# EAGLE design CP3 (EAGLE 9.6.2)
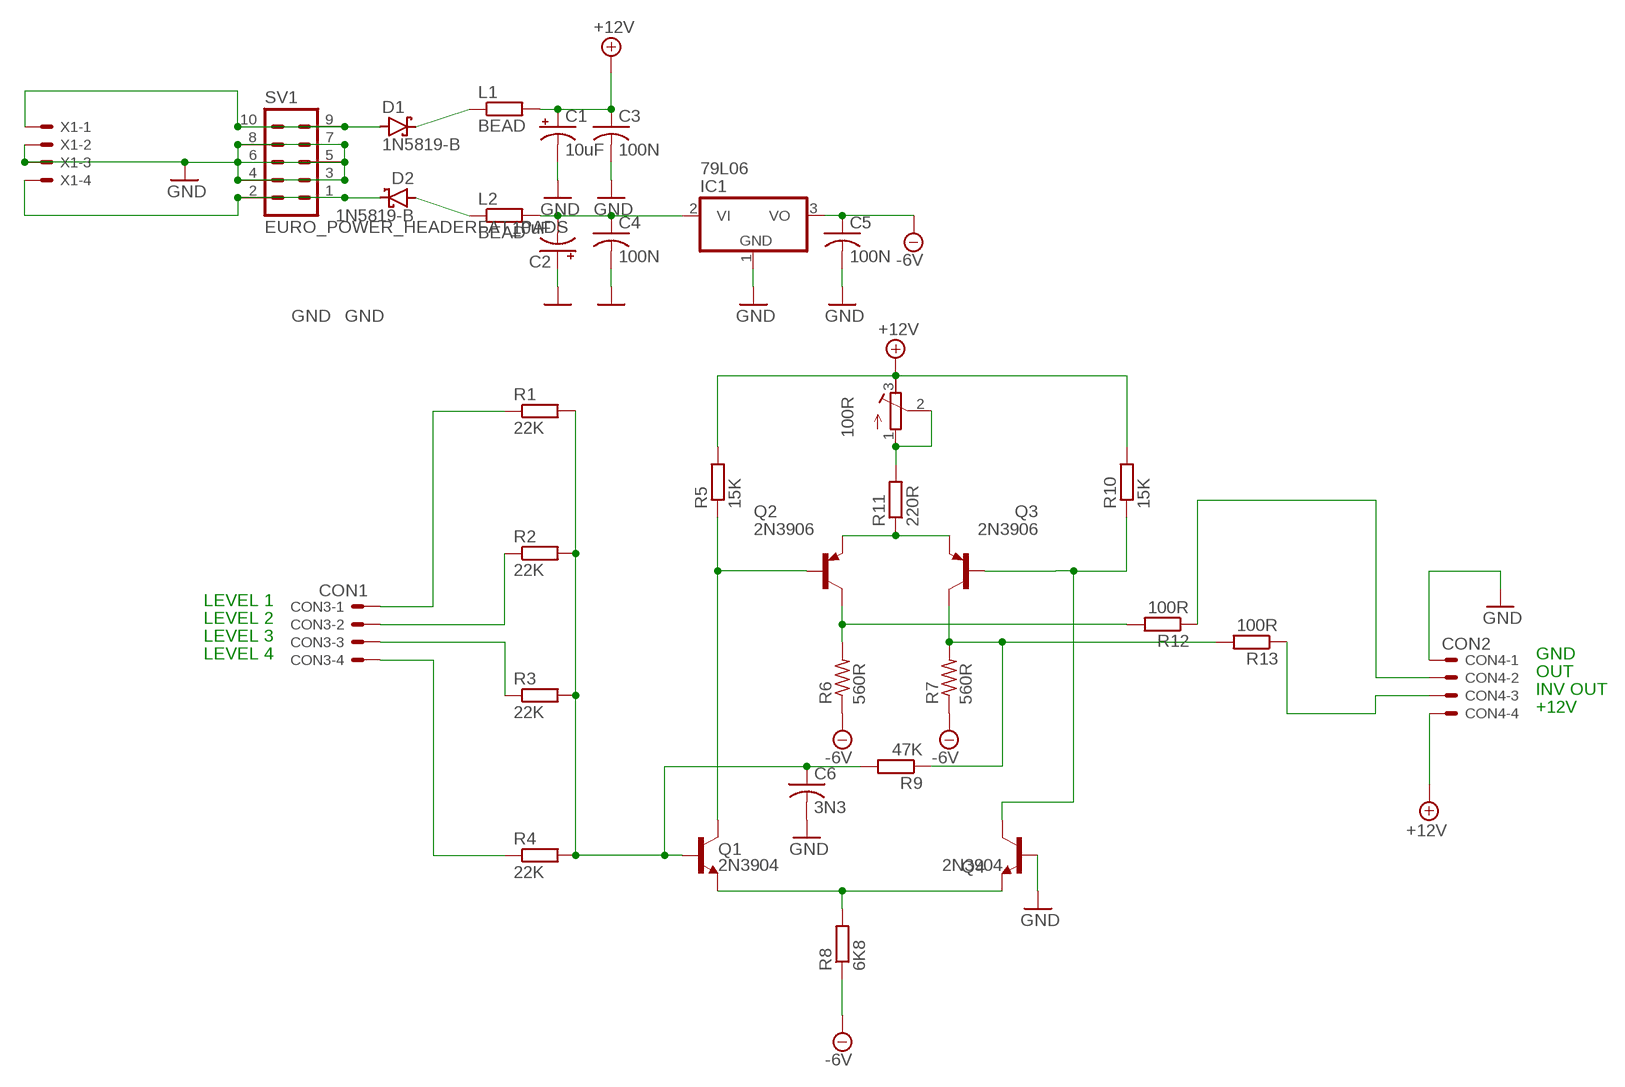
[diagram p0: schematic, sheet 1]

## Parts
100R  R-TRIMM3296W  [RTRIM3296W]
C1  10uF  CPOL-USE2.5-7  [E2,5-7]
C2  10uF  CPOL-USE2.5-7  [E2,5-7]
C3  100N  C-US025-025X050  [C025-025X050]
C4  100N  C-US025-025X050  [C025-025X050]
C5  100N  C-US025-025X050  [C025-025X050]
C6  3N3  C-US025-025X050  [C025-025X050]
CON3  CON1  22-23-2041  [22-23-2041]
CON4  CON2  22-23-2041  [22-23-2041]
D1  1N5819-B  [DO41-7.6]
D2  1N5819-B  [DO41-7.6]
IC1  79L06  79L12Z  [TO92]
L1  BEAD  RESISTOR10MM_RESISTOR  [10MM_RESISTOR]
L2  BEAD  RESISTOR10MM_RESISTOR  [10MM_RESISTOR]
Q1  2N3904  TRANS_NPN-2N3904  [TO-92]
Q2  2N3906  [TO92]
Q3  2N3906  [TO92]
Q4  2N3904  TRANS_NPN-2N3904  [TO-92]
R1  22K  RESISTOR10MM_RESISTOR  [10MM_RESISTOR]
R2  22K  RESISTOR10MM_RESISTOR  [10MM_RESISTOR]
R3  22K  RESISTOR10MM_RESISTOR  [10MM_RESISTOR]
R4  22K  RESISTOR10MM_RESISTOR  [10MM_RESISTOR]
R5  15K  RESISTOR10MM_RESISTOR  [10MM_RESISTOR]
R6  560R  R-US_0207/12  [0207/12]
R7  560R  R-US_0207/12  [0207/12]
R8  6K8  RESISTOR10MM_RESISTOR  [10MM_RESISTOR]
R9  47K  RESISTOR10MM_RESISTOR  [10MM_RESISTOR]
R10  15K  RESISTOR10MM_RESISTOR  [10MM_RESISTOR]
R11  220R  RESISTOR10MM_RESISTOR  [10MM_RESISTOR]
R12  100R  RESISTOR10MM_RESISTOR  [10MM_RESISTOR]
R13  100R  RESISTOR10MM_RESISTOR  [10MM_RESISTOR]
SV1  EURO_POWER_HEADERFAT_PADS  [EURO_PWR_HEADER_FAT]
X1  KK-156-4  [KK-156-4]

## Nets
+12V: 100R.3(E) C1.+ C3.1 CON4.4 L1.2 R5.2 R10.2
-5V: C5.1 IC1.3(VO) R6.1 R7.1 R8.1 ; supply symbol labelled -6V
GND: C1.- C2.+ C3.2 C4.2 C5.2 C6.2 CON4.1 IC1.1(GND) Q4.2(B) SV1.3 SV1.4 SV1.5 SV1.6 SV1.7 SV1.8 X1.2 X1.3
N$2: D1.A SV1.9 SV1.10 X1.1
N$3: D1.C L1.1
N$4: D2.C SV1.1 SV1.2 X1.4
N$5: D2.A L2.1
N$6: C2.- C4.1 IC1.2(VI) L2.2
N$10: CON3.1 R1.1
N$11: CON3.2 R2.1
N$12: CON3.3 R3.1
N$13: CON3.4 R4.1
N$14: C6.1 Q1.2(B) R1.2 R2.2 R3.2 R4.2 R9.2
N$15: Q1.1(E) Q4.1(E) R8.2
N$16: Q1.3(C) Q2.2(B) R5.1
N$17: Q2.1(C) R6.2 R12.2
N$18: Q3.1(C) R7.2 R9.1 R13.2
N$19: Q2.3(E) Q3.3(E) R11.1
N$20: 100R.1(A) 100R.2(S) R11.2
N$21: CON4.3 R13.1
N$22: Q3.2(B) Q4.3(C) R10.1
N$23: CON4.2 R12.1

## Notes on the sheet
- LEVEL 1
- LEVEL 2
- LEVEL 3
- LEVEL 4 | GND
- OUT
- INV OUT
- +12V

## Library data of the parts
100R = rcl:R-TRIMM: Trimm resistor; SPICEMODEL: X; SPICEPREFIXL: POT
C1 C2 = adafruit:CPOL-US: POLARIZED CAPACITOR, American symbol
C3-C6 = adafruit:C-US: CAPACITOR, American symbol
CON3 CON4 = con-molex:22-23-2041: .100" (2.54mm) Center Header - 4 Pin; MF: MOLEX; MPN: 22-23-2041; OC_FARNELL: 1462920; OC_NEWARK: 38C0355
D1 D2 = diode:1N581*: 1.0A SCHOTTKY BARRIER RECTIFIER Source: http://www.diodes.com/datasheets/ds23001.pdf
IC1 = linear:79*: Negative VOLTAGE REGULATOR
L1 L2 R1-R5 R8-R13 = MusicThingModular:RESISTOR: Standard resistor, various versions
Q1 Q4 = SparkFun-DiscreteSemi:TRANS_NPN: NPN transistor Current controlled devices typically used to amplify current or used as a switch. BC547 - COM-08928 <http://www.sparkfun.com/products/8928> (TO-92 45V 100mA) (1.Collector 2.Base 3.Emitter) 2N3904 - COM-00521 <http://www.sparkfun.com/products/521> (TO-92 40V 200mA) (1.Emitter 2.Base 3.Collector) P2N2222A - COM-12852 <http://www.sparkfun.com/products/12852> (TO-92 40V 600mA) (1.Collector 2.Base 3.Emitter); PROD_ID: TRANS-08447; VALUE: 200mA/40V
Q2 Q3 = transistor-pnp:2N3906: PNP Transistor
R6 R7 = adafruit:R-US_: RESISTOR, American symbol
SV1 = MusicThingModular:EURO_POWER_HEADER: Power Header 10 pin power header for Eurorack Power Supplies Variants with fatter pads for easier soldering, and the LOCK variant which has 5mil offset pins to hold the component in place before soldering
X1 = con-molex:KK-156-4: KK 156 HEADER Source: http://www.molex.com/pdm_docs/sd/026604100_sd.pdf; MF: MOLEX; OC_FARNELL: unknown; OC_NEWARK: unknown

## Board
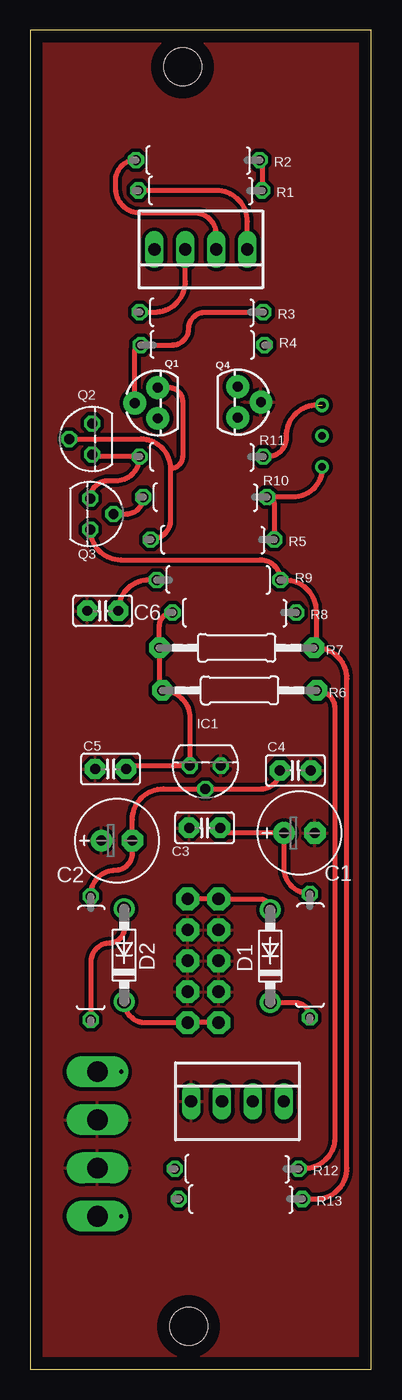
[diagram p1: board, top side]
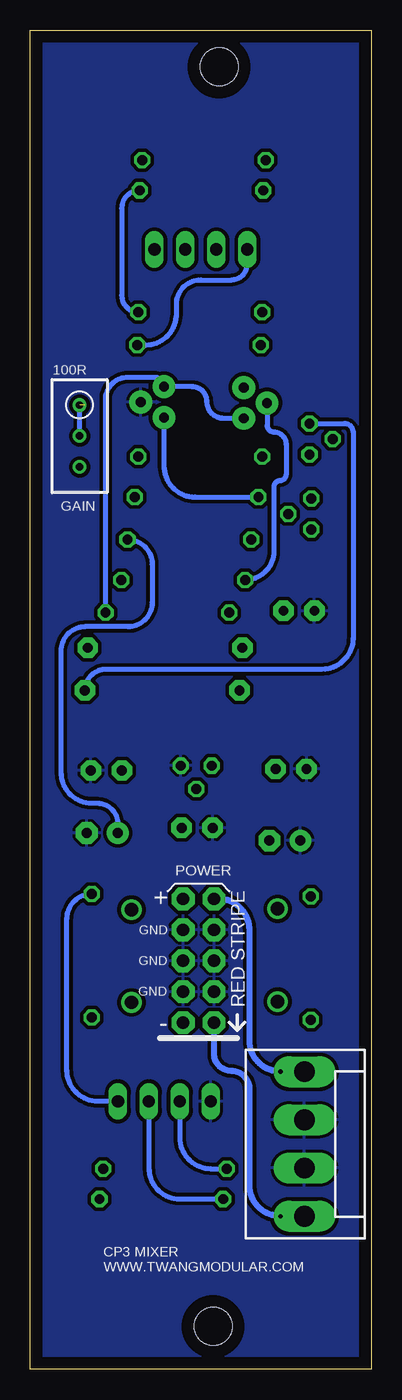
[diagram p2: board, bottom side, seen from below]

Size 28 x 110 mm. Coordinates in mm from the lower left corner, seen from the top.
Outline: 0,0 28,0 28,110 0,110 0,0
Copper layers (1*16): Top 0.035mm / dielectric 1.5mm / Bottom 0.035mm
Design rules "default": minimum track width 6mil, minimum drill 0.35mm, track to track 6mil, track to pad 6mil, pad to pad 6mil, via to via 6mil, smd to smd 6mil, copper to edge 40mil, drill to drill 6mil, minimum pad ring 10mil, minimum via ring 8mil, stop-mask expansion 4mil, vias tented up to drill 0mil, thermal gap 10mil
Holes 3.1 mm at 13,3.5 12.5,107

### Footprints (pad centres in the part's own frame; a part is rotated, then mirrored left to right if it is on the bottom)
RTRIM3296W = drill 0.61: 1 0,-2.54; 2 0,0; 3 0,2.54
E2,5-7 = drill 0.813 pad 1.778: + -1.27,0 | drill 0.813 pad 1.778 octagon: - 1.27,0
C025-025X050 = drill 0.813 pad 1.676 octagon: 1 -1.27,0; 2 1.27,0
22-23-2041 = drill 1 long: 1 -3.81,0; 2 -1.27,0; 3 1.27,0; 4 3.81,0
DO41-7.6 = drill 1.1 pad 1.7: A 3.81,0; C -3.81,0
TO92 = drill 0.813 octagon: 1 -1.27,0; 2 0,1.905; 3 1.27,0
10MM_RESISTOR = drill 0.813 octagon: 1 -5.08,0; 2 5.08,0
TO-92 = drill 0.813 pad 1.88: 1 -1.27,0; 2 0,1.905; 3 1.27,0
TO92' = drill 0.813 octagon: 1 1.27,0; 2 0,1.905; 3 -1.27,0
0207/12 = drill 0.813 pad 1.676 octagon: 1 -6.35,0; 2 6.35,0
EURO_PWR_HEADER_FAT = drill 1.016 pad 1.88 octagon: 1 -5.08,-1.27; 2 -5.08,1.27; 3 -2.54,-1.27; 4 -2.54,1.27; 5 0,-1.27; 6 0,1.27; 7 2.54,-1.27; 8 2.54,1.27; 9 5.08,-1.27; 10 5.08,1.27
KK-156-4 = drill 1.7 pad 2.184 long: 1 -5.94,0; 2 -1.98,0; 3 1.98,0; 4 5.94,0

### Placement (x,y rotation side)
100R  23.96,76.67 180 bottom
C1  22.1,44.05 0 top
C2  7.1,43.43 0 top
C3  14.31,44.47 180 top
C4  21.76,49.19 0 top
C5  6.59,49.31 180 top
C6  5.94,62.31 180 top
CON3  14,92 180 top
CON4  17,22 0 top
D1  19.7,33.94 90 top
D2  7.7,34.01 90 top
IC1  14.37,49.58 180 top
L1  22.96,33.97 90 top
L2  4.96,33.77 90 top
Q1  10.47,79.39 90 top
Q2  2N3906  [TO92']  5.08,76.43 90 top
Q3  2N3906  [TO92']  4.92,70.27 270 top
Q4  17.03,79.46 270 top
R1  13.95,96.85 0 top
R2  13.75,99.35 0 top
R3  14.05,86.85 0 top
R4  14.15,84.15 180 top
R5  14.95,68.16 0 top
R6  17.18,55.77 0 top
R7  16.94,59.27 0 top
R8  16.75,62.16 0 top
R9  15.45,64.84 180 top
R10  14.35,71.66 0 top
R11  14.05,74.97 0 top
R12  16.95,16.47 0 top
R13  17.25,13.97 0 top
SV1  14.19,33.55 90 bottom
X1  5.5,18.5 270 bottom

### Tracks (layer width: path | path; a pad name or v marks a point on that pad's centre or on a via)
+12V
  Top 0.406: L1.2 arc-90 20.83,41.18 C1.+ 16,44.05 arc-90 C3.1 | R5.2 20.03,71.06 arc90 R10.2 21.57,71.66 arc90 23.96,74.05 100R.3
  Bottom 0.406: R5.2 arc90 18,66.13 18,63 arc90 20,61 23.5,61 arc-90 25.5,59 25.5,49.04 arc-90 22.96,46.5 22.5,46.5 arc90 20.83,44.83 C1.+ | CON4.4 22.46,22 arc90 25,24.54 25,37.01 arc90 L1.2
-5V
  Top 0.406: C5.1 arc-90 8.13,49.58 IC1.3 13.1,53.5 arc90 R6.1 arc-90 10.59,56.01 R7.1 10.59,61.08 arc-90 R8.1
GND
  pour Top (isolate 0.305): -0.5,-1 29,-1 29,111 -0.5,111
  pour Bottom (isolate 0.305): -1,-1.5 29.5,-1.5 29.5,111.5 -1,111.5
N$2  (via drill 0.35)
  Top 0.406: SV1.9 SV1.10 18.82,38.63 arc-90 D1.A
  Top 0.508: X1.1 v7.46,24.44
  Bottom 0.508: v7.46,24.44 arc90 10,26.98 10,36.09 arc-90 12.54,38.63 SV1.9
N$3
  Top 0.406: D1.C 21.72,30.13 arc-90 L1.1
N$4  (via drill 0.35)
  Top 0.406: SV1.2 SV1.1 9.43,28.47 arc-90 D2.C
  Top 0.508: X1.4 v7.46,12.56
  Bottom 0.508: v7.46,12.56 arc90 10,15.1 10,23 arc-90 11.5,24.5 arc90 12.92,25.92 SV1.1
N$5
  Top 0.406: D2.A 7.7,36.2 arc-90 6.5,35 arc90 4.96,33.46 L2.1
N$6
  Top 0.406: L2.2 4.96,38.96 arc-90 7,41 arc90 8.37,42.37 C2.- 8.37,45.13 arc-90 10.91,47.67 IC1.2 18.98,47.67 arc90 C4.1
N$10
  Top 0.406: CON3.1 17.81,94.31 arc90 15.27,96.85 R1.1
N$11
  Top 0.406: CON3.2 15.27,93.23 arc90 13.5,95 9,95 arc-90 7,97 7,97.68 arc-90 R2.1
N$12
  Top 0.406: R3.1 10.19,86.85 arc90 12.73,89.39 CON3.3
N$13
  Bottom 0.406: R4.1 18.54,84.15 arc-90 16,86.69 16,87.5 arc90 14,89.5 11.5,89.5 arc-90 10.19,90.81 CON3.4
N$14
  Top 0.406: R9.2 9.74,64.84 arc90 C6.1 | Q1.2 8.56,83.64 arc-90 R4.2 11.65,84.15 arc90 13,85.5 arc-90 14.35,86.85 R3.2 | R2.2 arc-90 19.03,99.15 R1.2
  Bottom 0.406: R1.2 arc-90 20.5,95.38 20.5,88.22 arc-90 R3.2 | Q1.2 8.56,77.56 arc-90 8,77 arc90 7,76 7,73.5 arc90 7.5,73 arc-90 8,72.5 8,67.21 arc90 R9.2
N$15
  Bottom 0.406: Q1.1 12.12,78.12 arc90 13.5,79.5 arc-90 14.73,80.73 Q4.1 arc-90 17.8,81.5 20,81.5 arc-90 21.83,79.67 R8.2
N$16
  Top 0.406: Q2.2 9.07,76.43 arc-90 11.5,74 | 11.5,74 11.5,69.79 arc-90 R5.1 | Q1.3 11.34,80.66 arc-90 12.5,79.5 12.5,75 arc-90 11.5,74
N$17
  Top 0.406: R6.2 arc-90 25,54.3 25,19.01 arc-90 22.46,16.47 R12.2
  Bottom 0.406: Q2.1 2.2,77.7 arc90 1.5,77 1.5,60.04 arc90 4.04,57.5 21.8,57.5 arc-90 R6.2
N$18
  Top 0.406: R13.2 23.46,13.97 arc90 26,16.51 26,56.73 arc90 23.46,59.27 | 23.46,59.27 R7.2 | 23.46,59.27 23.46,62.3 arc90 20.92,64.84 R9.1 arc90 18.87,66.5 7.42,66.5 arc-90 Q3.1
N$19
  Top 0.406: Q3.3 arc-90 6.38,73 7,73 arc90 R11.1 5.27,74.97 arc-90 Q2.3
N$20  (1 unrouted)
  Top 0.406: 23.54,79.21 arc90 21,76.67 21,76.5 arc-90 19.47,74.97 R11.2
  Bottom 0.406: 100R.2 100R.1
N$21
  Bottom 0.406: CON4.3 18.27,16.51 arc-90 15.73,13.97 R13.1
N$22
  Top 0.406: Q3.2 7.88,70.27 arc90 R10.1
  Bottom 0.406: Q4.3 17.03,74.2 arc-90 14.49,71.66 R10.1
N$23
  Bottom 0.406: CON4.2 15.73,19.01 arc-90 13.19,16.47 R12.1

### Text on the board
bNames: GAIN | CP3 MIXER / WWW.TWANGMODULAR.COM